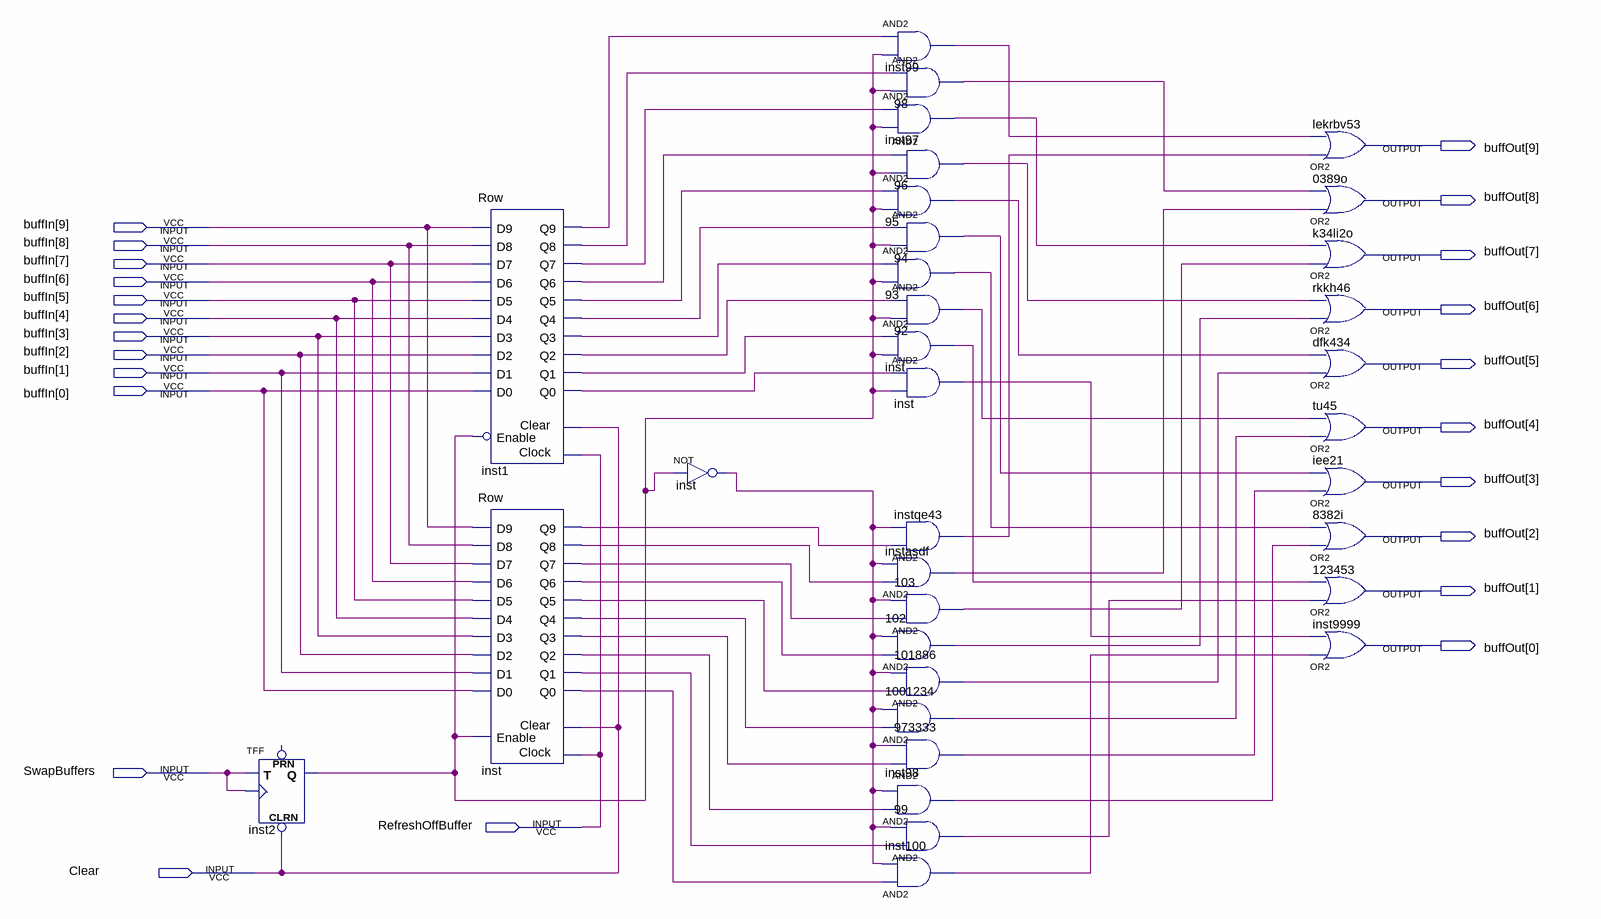
[diagram p0: schematic sheet]
// Quartus schematic RowBuffer.bdf as structural Verilog: 34 symbols, 23 pins
module RowBuffer (
  input  [9:0] buffIn,
  input  SwapBuffers,
  input  RefreshOffBuffer,
  input  Clear,
  output [9:0] buffOut
);

  wire inst1_q0, inst1_q1, inst1_q2, inst1_q3, inst1_q4, inst1_q5, inst1_q6, inst1_q7, inst1_q8, inst1_q9,
       inst2_q, inst97_out, inst98_out, inst99_out, inst100_out, inst_out, inst_out_2, inst_out_3, inst_q0,
       inst_q1, inst_q2, inst_q3, inst_q4, inst_q5, inst_q6, inst_q7, inst_q8, inst_q9, instasdf_out,
       instqe43_out, n92_out, n93_out, n94_out, n95_out, n96_out, n98_out, n99_out, n102_out, n103_out,
       n101886_out, n973333_out, n1001234_out;

  TFF inst2 (.CLRN(Clear), .T(SwapBuffers), .CLK(SwapBuffers), .Q(inst2_q));  // open: PRN
  Row inst1 (
    .Clear(Clear), .Clock(RefreshOffBuffer), .D0(buffIn[0]), .D1(buffIn[1]), .D2(buffIn[2]), .D3(buffIn[3]),
    .D4(buffIn[4]), .D5(buffIn[5]), .D6(buffIn[6]), .D7(buffIn[7]), .D8(buffIn[8]), .D9(buffIn[9]),
    .Enable(~inst2_q), .Q0(inst1_q0), .Q1(inst1_q1), .Q2(inst1_q2), .Q3(inst1_q3), .Q4(inst1_q4),
    .Q5(inst1_q5), .Q6(inst1_q6), .Q7(inst1_q7), .Q8(inst1_q8), .Q9(inst1_q9));
  Row inst (
    .D1(buffIn[1]), .D3(buffIn[3]), .D4(buffIn[4]), .D5(buffIn[5]), .D6(buffIn[6]), .D7(buffIn[7]),
    .D0(buffIn[0]), .D2(buffIn[2]), .D9(buffIn[9]), .D8(buffIn[8]), .Enable(inst2_q),
    .Clock(RefreshOffBuffer), .Clear(Clear), .Q0(inst_q0), .Q1(inst_q1), .Q2(inst_q2), .Q3(inst_q3),
    .Q4(inst_q4), .Q5(inst_q5), .Q6(inst_q6), .Q7(inst_q7), .Q8(inst_q8), .Q9(inst_q9));
  not inst_dup2 (inst_out_3, inst2_q);
  and inst99 (inst99_out, inst1_q9, inst2_q);
  and u_98 (n98_out, inst1_q8, inst2_q);
  and inst97 (inst97_out, inst1_q7, inst2_q);
  and u_96 (n96_out, inst1_q6, inst2_q);
  and u_95 (n95_out, inst1_q5, inst2_q);
  and u_94 (n94_out, inst1_q4, inst2_q);
  and u_93 (n93_out, inst1_q3, inst2_q);
  and u_92 (n92_out, inst1_q2, inst2_q);
  and inst_dup3 (inst_out_2, inst1_q1, inst2_q);
  and inst_dup4 (inst_out, inst1_q0, inst2_q);
  and instqe43 (instqe43_out, inst_q9, inst_out_3);
  and instasdf (instasdf_out, inst_q8, inst_out_3);
  and u_103 (n103_out, inst_q7, inst_out_3);
  and u_102 (n102_out, inst_q6, inst_out_3);
  and u_101886 (n101886_out, inst_q5, inst_out_3);
  and u_1001234 (n1001234_out, inst_q4, inst_out_3);
  and u_973333 (n973333_out, inst_q3, inst_out_3);
  and inst98 (inst98_out, inst_q2, inst_out_3);
  and u_99 (n99_out, inst_q1, inst_out_3);
  and inst100 (inst100_out, inst_q0, inst_out_3);
  or lekrbv53 (buffOut[9], instqe43_out, inst99_out);
  or u_0389o (buffOut[8], instasdf_out, n98_out);
  or k34li2o (buffOut[7], n103_out, inst97_out);
  or rkkh46 (buffOut[6], n102_out, n96_out);
  or dfk434 (buffOut[5], n101886_out, n95_out);
  or tu45 (buffOut[4], n1001234_out, n92_out);
  or iee21 (buffOut[3], n973333_out, n94_out);
  or u_8382i (buffOut[2], inst98_out, n93_out);
  or u_123453 (buffOut[1], n99_out, inst_out_2);
  or inst9999 (buffOut[0], inst100_out, inst_out);
endmodule
